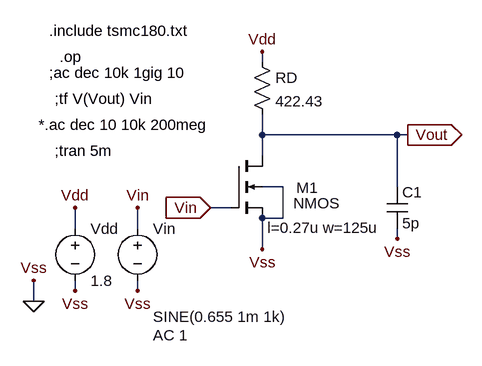
[diagram p0: schematic CS_amp_with_passiveLoad_pres.asc]
CS_amp_with_passiveLoad_pres.asc, the LTspice schematic file:
Version 4
SHEET 1 944 680
WIRE 432 -48 432 -64
WIRE 432 64 432 32
WIRE 640 64 432 64
WIRE 656 64 640 64
WIRE 432 96 432 64
WIRE 464 144 432 144
WIRE 640 144 640 64
WIRE 384 176 352 176
WIRE 464 192 464 144
WIRE 464 192 432 192
WIRE 144 208 144 176
WIRE 240 208 240 176
WIRE 640 224 640 208
WIRE 432 240 432 192
WIRE 144 304 144 288
WIRE 240 304 240 288
WIRE 80 320 80 288
FLAG 80 320 0
FLAG 80 288 Vss
FLAG 240 176 Vin
FLAG 144 304 Vss
FLAG 240 304 Vss
FLAG 144 176 Vdd
FLAG 432 -64 Vdd
FLAG 352 176 Vin
IOPIN 352 176 In
FLAG 432 240 Vss
FLAG 656 64 Vout
IOPIN 656 64 Out
FLAG 640 224 Vss
SYMBOL nmos4 384 96 R0
WINDOW 0 101 49 Left 2
WINDOW 3 96 73 Left 2
WINDOW 123 56 111 Left 2
SYMATTR InstName M1
SYMATTR Value2 l=0.27u w=125u
SYMBOL voltage 144 192 R0
WINDOW 123 0 0 Left 0
WINDOW 39 0 0 Left 0
SYMATTR InstName Vdd
SYMATTR Value 1.8
SYMBOL voltage 240 192 R0
WINDOW 3 24 152 Left 2
WINDOW 123 24 180 Left 2
WINDOW 39 0 0 Left 0
SYMATTR Value SINE(0.655 1m 1k)
SYMATTR Value2 AC 1
SYMATTR InstName Vin
SYMBOL res 416 -64 R0
SYMATTR InstName RD
SYMATTR Value 422.43
SYMBOL cap 624 144 R0
SYMATTR InstName C1
SYMATTR Value 5p
TEXT 104 -96 Left 2 !.include tsmc180.txt
TEXT 120 -56 Left 2 !.op
TEXT 104 -32 Left 2 !;ac dec 10k 1gig 10
TEXT 112 8 Left 2 !;tf V(Vout) Vin
TEXT 88 48 Left 2 !*.ac dec 10 10k 200meg
TEXT 112 88 Left 2 !;tran 5m

The netlist it stands for:
* CS_amp_with_passiveLoad_pres.asc
M1 Vout Vin 0 0 NMOS l=0.27u w=125u
Vdd Vdd 0 1.8
Vin Vin 0 SINE(0.655 1m 1k) AC 1
RD Vdd Vout 422.43
C1 Vout 0 5p
.model NMOS NMOS
.model PMOS PMOS
.lib standard.mos
.include tsmc180.txt
.op
;ac dec 10k 1gig 10
;tf V(Vout) Vin
*.ac dec 10 10k 200meg
;tran 5m
.backanno
.end